# EAGLE board draft10_tofab (EAGLE 6.3)
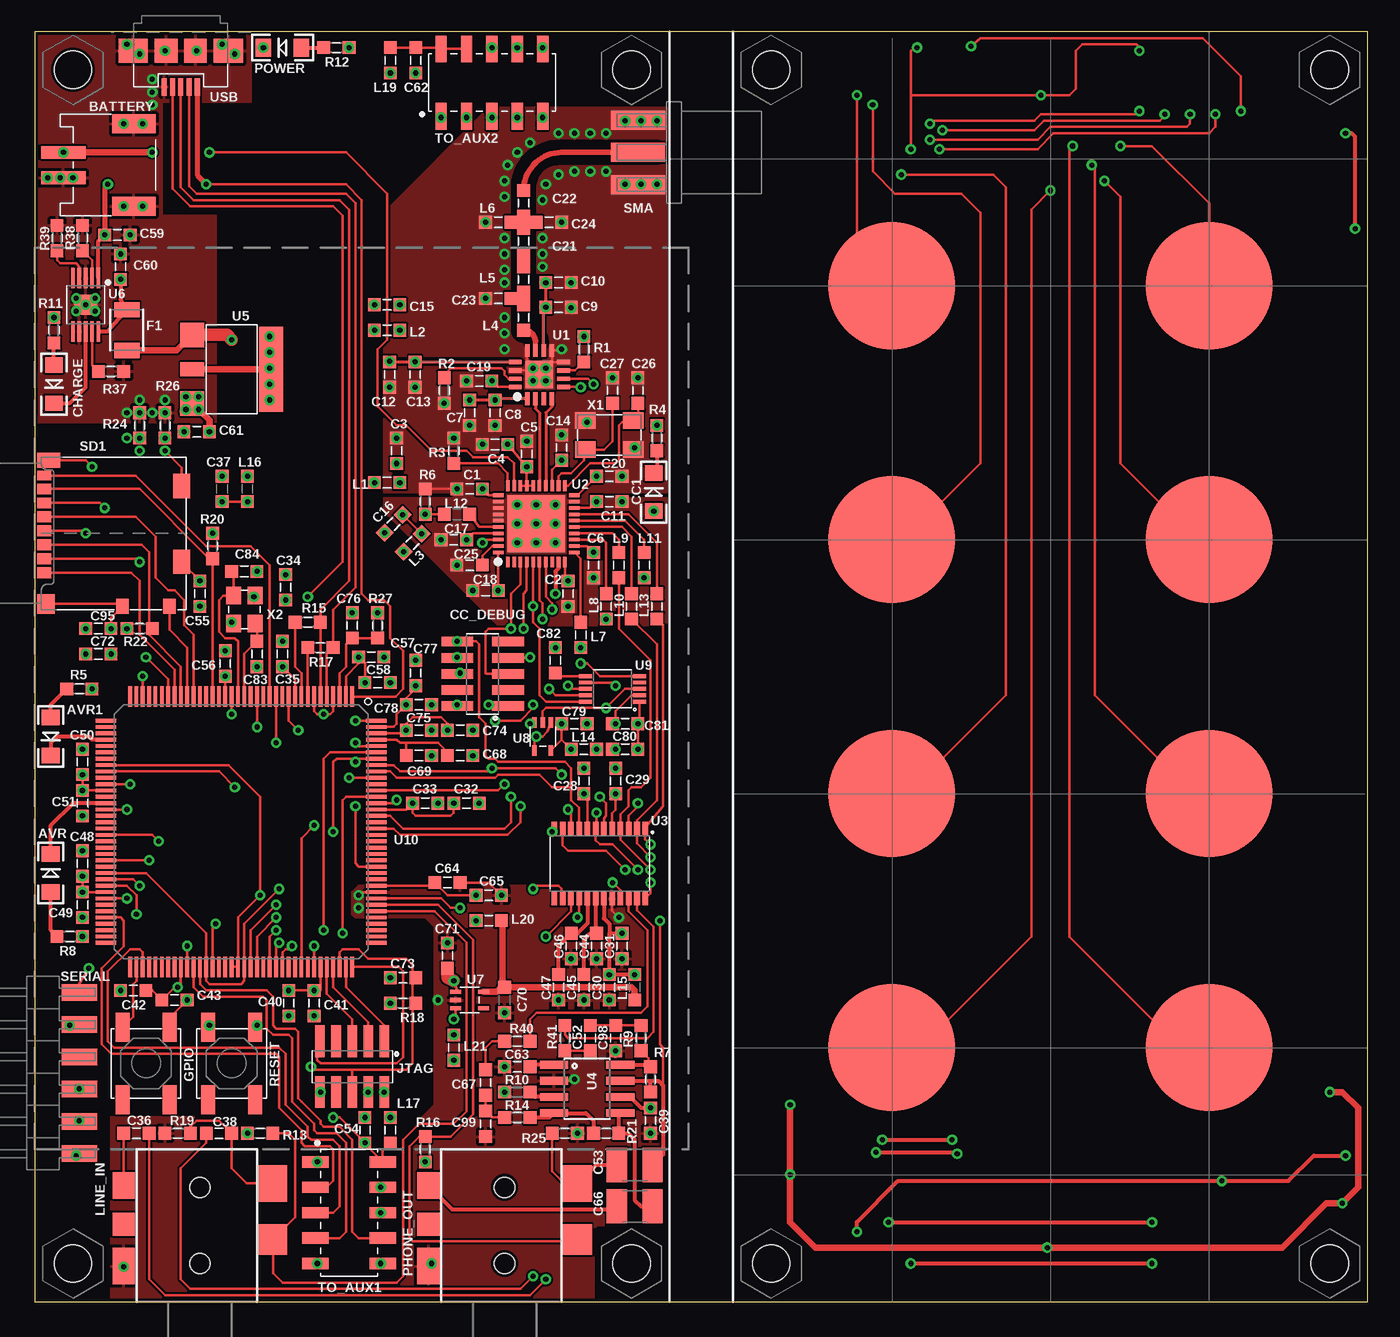
[diagram p5: board, top side]
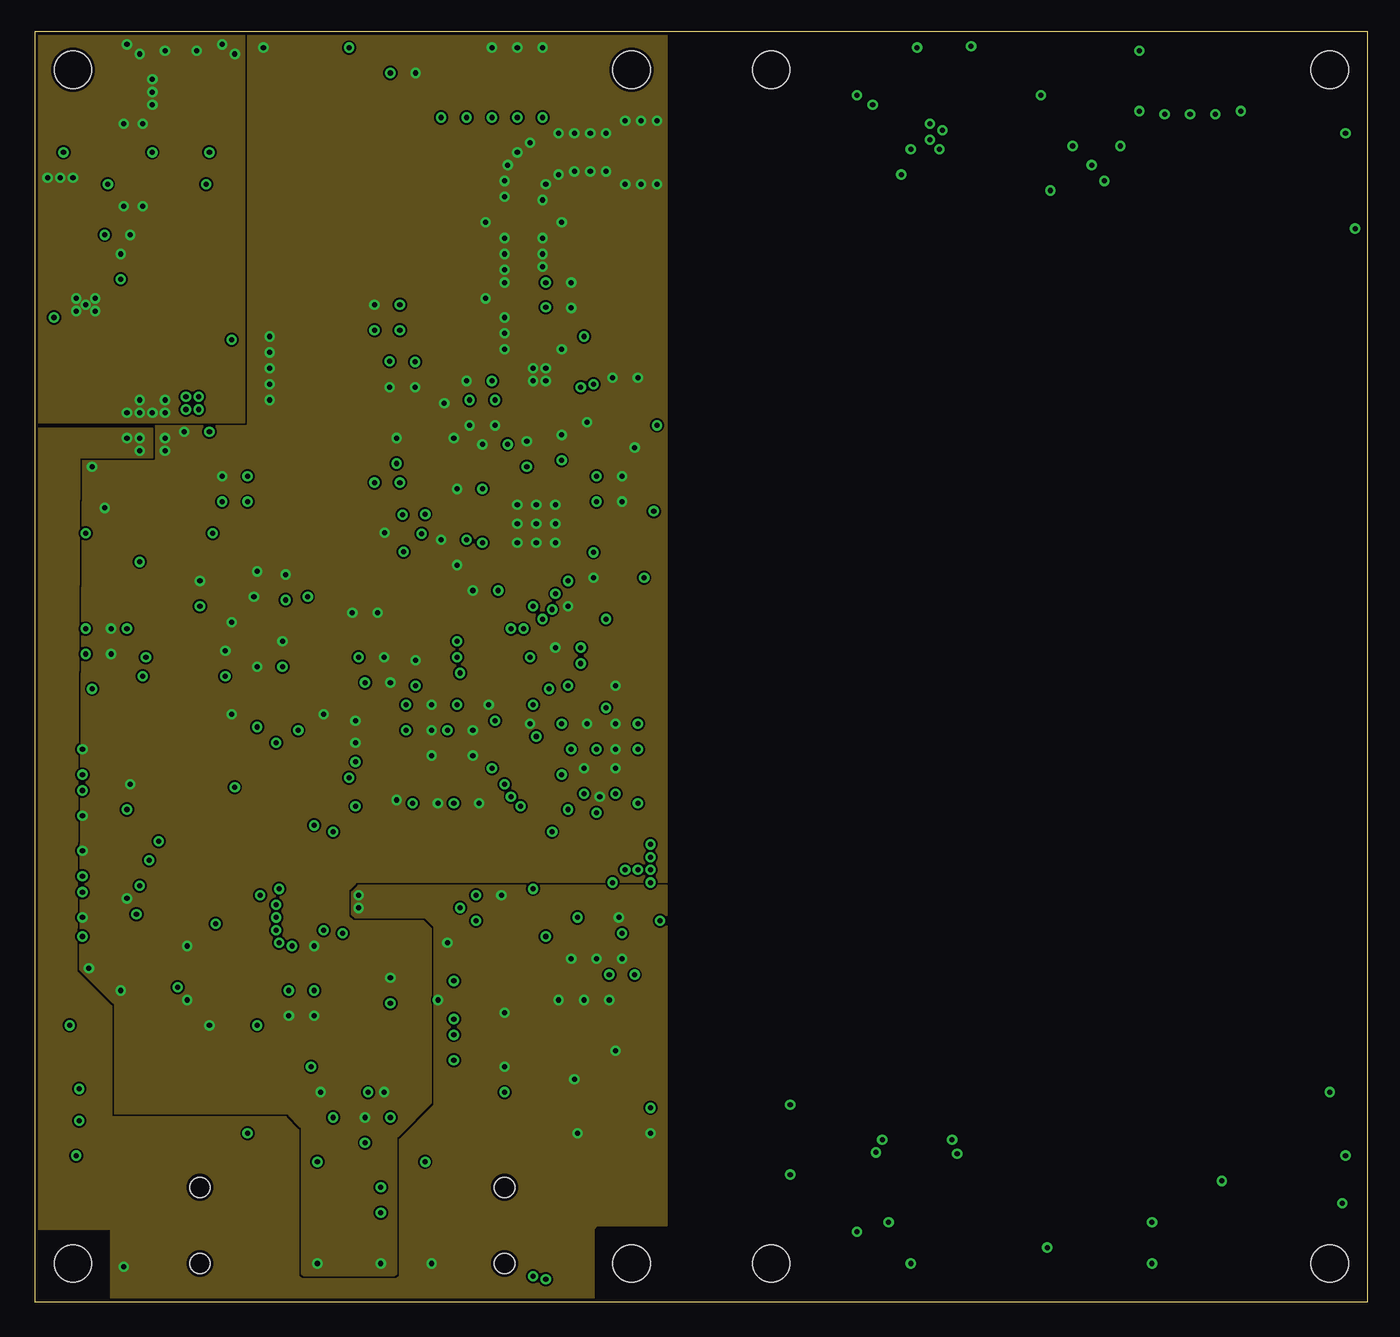
[diagram p6: board, inner layer Route2]
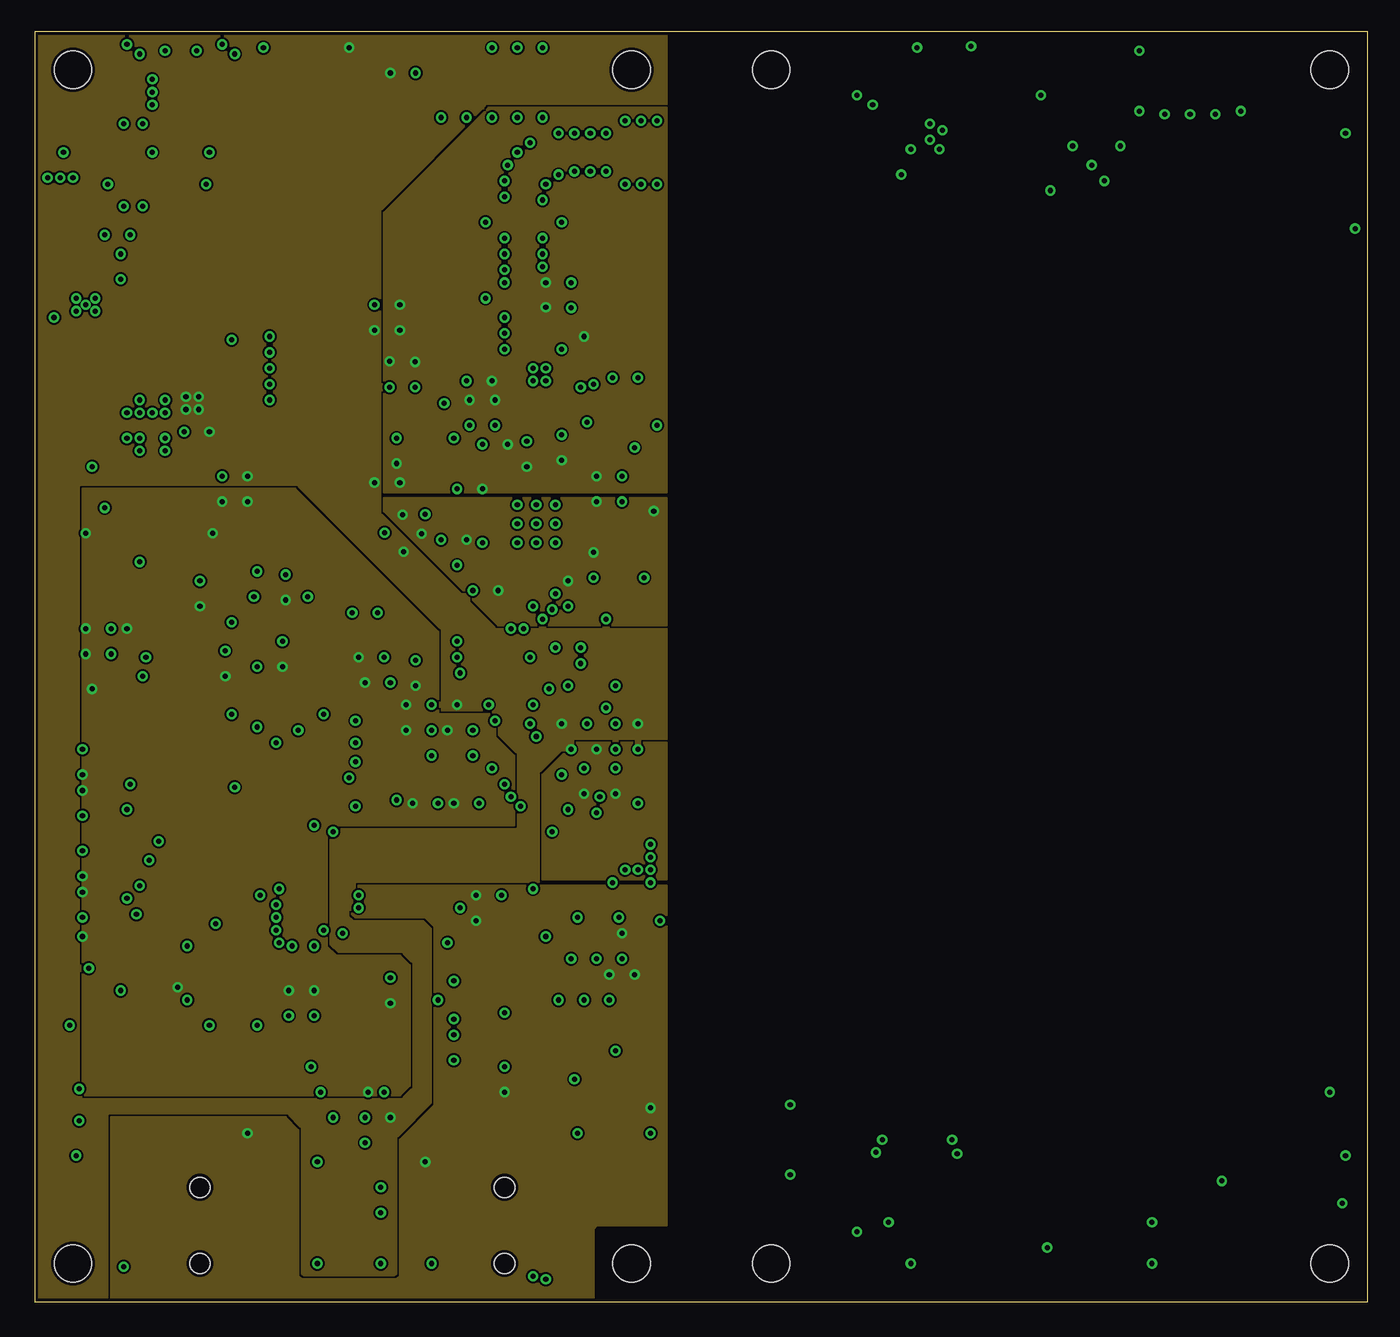
[diagram p7: board, inner layer Route3]
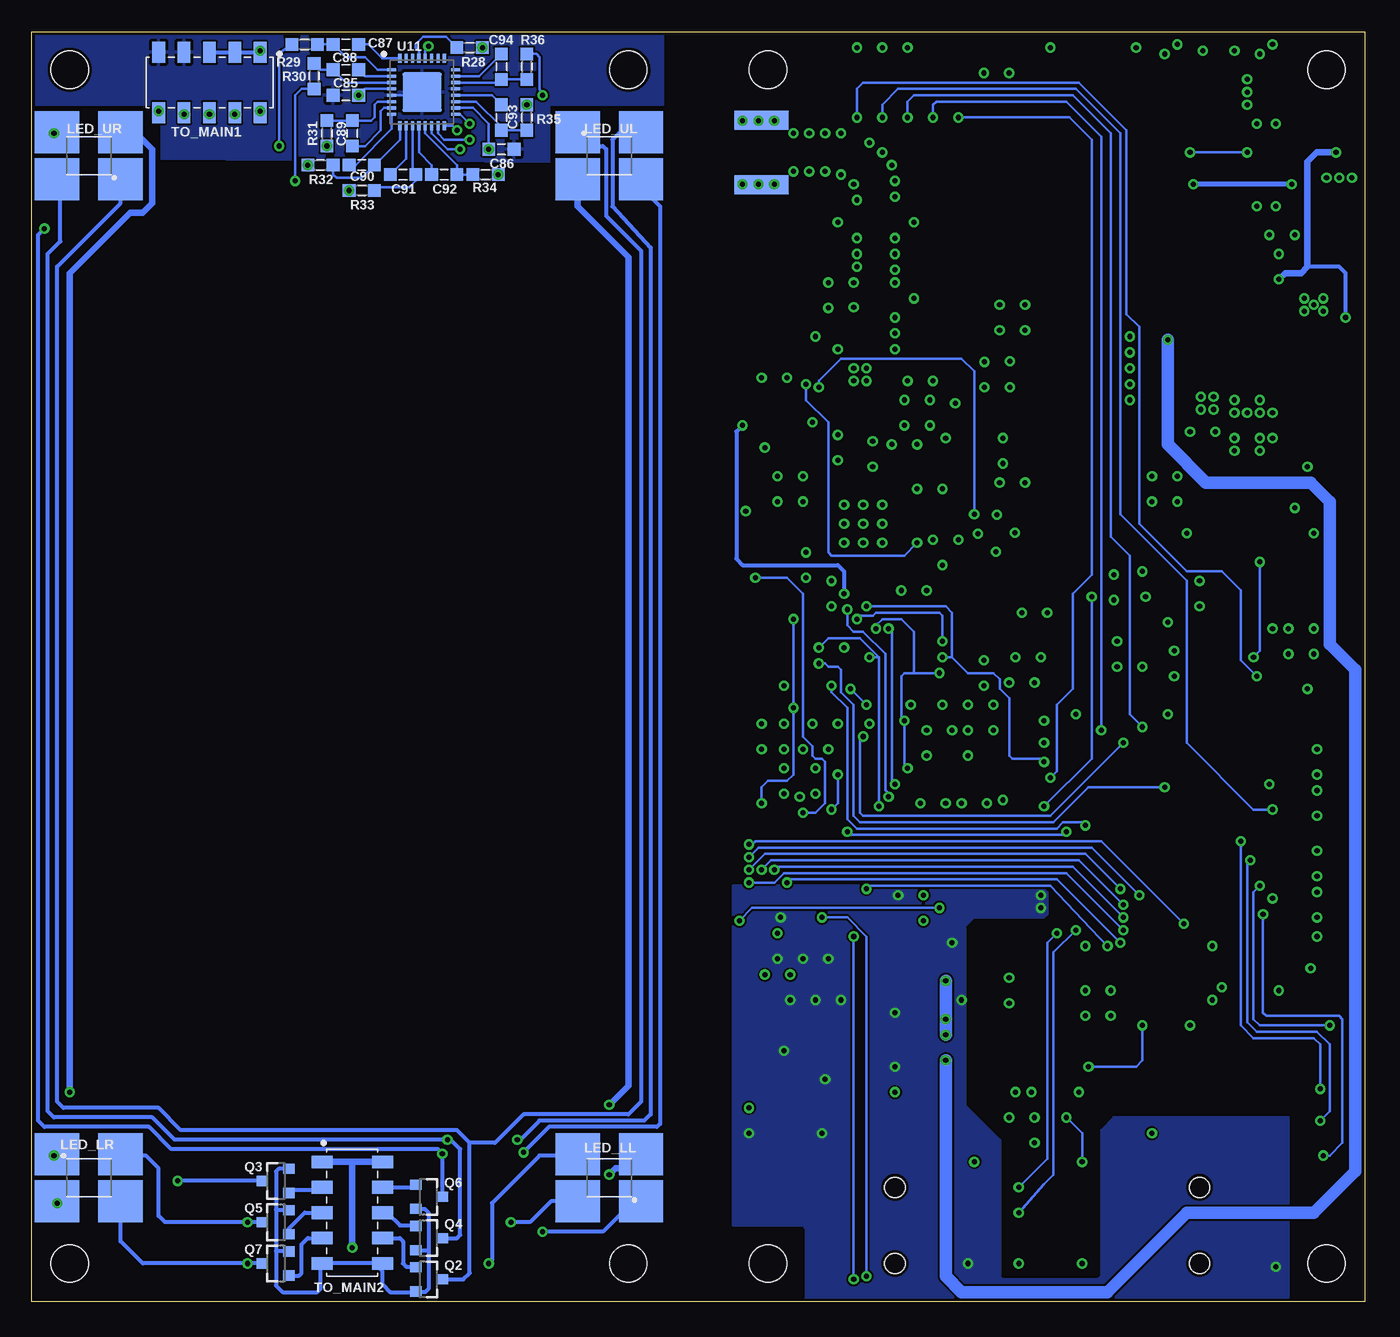
[diagram p8: board, bottom side, seen from below]

Size 105 x 100 mm. Coordinates in mm from the lower left corner, seen from the top.
Outline: 0,0 105,0 105,100 0,100 0,0
Copper layers (1+2*3+16): Top 0.034290625mm / dielectric 0.24891875mm / Route2 0.034290625mm / dielectric 39mil / Route3 0.034290625mm / dielectric 0.24891875mm / Bottom 0.034290625mm
Design rules "66each *": minimum track width 6mil, minimum drill 15mil, track to track 6mil, track to pad 6mil, pad to pad 6mil, via to via 6mil, smd to smd 0mil, copper to edge 10mil, drill to drill 10mil, minimum pad ring 10mil, minimum via ring 8mil, stop-mask expansion 4mil, vias tented up to drill 0mil, thermal gap 10mil
tRestrict: 7 lines

## Footprints (pad centres in the part's own frame; a part is rotated, then mirrored left to right if it is on the bottom)
LED-1206 = smd 1.2 x 1.4: A -1.5,0; C 1.5,0
1775469-2 = smd 1 x 3.5: + -1,-1.75; - 1,-1.75 | smd 1.5 x 3.4: X1 -3.25,3.8; X2 3.25,3.8
TOUCH-CIRCLE-10MM = smd 10 x 10: P$1 0,0
C0603 = smd 1 x 1: 1 -1,0; 2 1,0
C1210 = smd 1.6 x 2.7: 1 -1.4,0; 2 1.4,0
HEADER-10P-1.27MM = smd 0.75 x 2.5: 1 -2.54,-2; 2 -2.54,2; 3 -1.27,-2; 4 -1.27,2; 5 0,-2; 6 0,2; 7 1.27,-2; 8 1.27,2; 9 2.54,-2; 10 2.54,2
1210 = smd 1.2 x 2: 1 -1.6,0; 2 1.6,0
PTS-525 = smd 2.3 x 1.1: 1 -2.85,1.85; 2 2.85,1.85; 3 -2.85,-1.85; 4 2.85,-1.85
0603 = smd 1 x 1: 1 -1,0; 2 1,0
PLCC-4 = smd 1.5 x 1.1: 1 -1.5,0.75; 2 -1.5,-0.75; 3 1.5,-0.75; 4 1.5,0.75 | smd 3.5 x 3.3: 1-2 -2.5,1.85; 2-2 -2.5,-1.85; 3-2 2.5,-1.85; 4-2 2.5,1.85
STX-35332-5N = smd 1.75 x 2.1: 1 -6,9.15 | smd 1.75 x 1.8: 2 -6,6.1 | smd 2.25 x 2.4: 3 5.75,4.9 | smd 2.25 x 2.9: 4 5.75,9.3 | smd 1.75 x 2.9: 5 -6,2.8 | hole 1.6: 0,9; 0,3
SOT23-3 = smd 0.8 x 0.9: 1 -0.95,-1; 2 0.95,-1; 3 0,1.1
R0603 = smd 1 x 1: 1 -1,0; 2 1,0
MOLEX_104031-0811 = smd 0.85 x 1.1: CD/DAT3 2.005,0.25; CLK -1.295,0.25; CMD 0.905,0.25; DAT0 -3.495,0.25; DAT2 3.105,0.25; VDD -0.195,0.25; VSS -2.395,0.25 | smd 0.75 x 1.1: DAT1 -4.545,0.25 | smd 1.55 x 1.35: GND1 5.565,0.375 | smd 1.17 x 1.8: GND2 -5.755,0.6 | smd 1.9 x 1.35: GND3 -3.73,11.075; GND4 2.24,11.075 | smd 1.2 x 1: SWA 5.74,6.4; SWB 5.74,10.1
HEADER-3M-961-6P-2.54MM = smd 1.3 x 2.8: 1 -6.35,0; 2 -3.81,0; 3 -1.27,0; 4 1.27,0; 5 3.81,0; 6 6.35,0
CONREVSMA003.062 = smd 4.25 x 1.5 bottom: GND1 2.25,-2.54; GND3 2.25,2.54 | smd 4.25 x 1.5: GND2 2.25,-2.54; GND4 2.25,2.54; SIG 2.25,0
M22-63405 = smd 0.89 x 2.1: 1 -4,-2.65; 2 -4,2.65; 3 -2,-2.65; 4 -2,2.65; 5 0,-2.65; 6 0,2.65; 7 2,-2.65; 8 2,2.65; 9 4,-2.65; 10 4,2.65
M22-53205 = smd 1 x 1.65: 1 -4,-2.375; 2 -4,2.375; 3 -2,-2.375; 4 -2,2.375; 5 0,-2.375; 6 0,2.375; 7 2,-2.375; 8 2,2.375; 9 4,-2.375; 10 4,2.375
S-PVQFN-N16 = smd 1 x 0.35: 1 -1.9,0.975; 2 -1.9,0.325; 3 -1.9,-0.325; 4 -1.9,-0.975; 9 1.9,-0.975; 10 1.9,-0.325; 11 1.9,0.325; 12 1.9,0.975 | smd 0.35 x 1: 5 -0.975,-1.9; 6 -0.325,-1.9; 7 0.325,-1.9; 8 0.975,-1.9; 13 0.975,1.9; 14 0.325,1.9; 15 -0.325,1.9; 16 -0.975,1.9 | smd 2.16 x 2.16: GND 0,0
S-PVQFN-N40 = smd 0.85 x 0.28: 1 -3,2.25; 2 -3,1.75; 3 -3,1.25; 4 -3,0.75; 5 -3,0.25; 6 -3,-0.25; 7 -3,-0.75; 8 -3,-1.25; 9 -3,-1.75; 10 -3,-2.25; 21 3,-2.25; 22 3,-1.75; 23 3,-1.25; 24 3,-0.75; 25 3,-0.25; 26 3,0.25; 27 3,0.75; 28 3,1.25; 29 3,1.75; 30 3,2.25 | smd 0.28 x 0.85: 11 -2.25,-3; 12 -1.75,-3; 13 -1.25,-3; 14 -0.75,-3; 15 -0.25,-3; 16 0.25,-3; 17 0.75,-3; 18 1.25,-3; 19 1.75,-3; 20 2.25,-3; 31 2.25,3; 32 1.75,3; 33 1.25,3; 34 0.75,3; 35 0.25,3; 36 -0.25,3; 37 -0.75,3; 38 -1.25,3; 39 -1.75,3; 40 -2.25,3 | smd 4.5 x 4.5: GND 0,0
TSSOP-24L = smd 1.05 x 0.45: 1 -2.775,3.575; 2 -2.775,2.925; 3 -2.775,2.275; 4 -2.775,1.625; 5 -2.775,0.975; 6 -2.775,0.325; 7 -2.775,-0.325; 8 -2.775,-0.975; 9 -2.775,-1.625; 10 -2.775,-2.275; 11 -2.775,-2.925; 12 -2.775,-3.575; 13 2.775,-3.575; 14 2.775,-2.925; 15 2.775,-2.275; 16 2.775,-1.625; 17 2.775,-0.975; 18 2.775,-0.325; 19 2.775,0.325; 20 2.775,0.975; 21 2.775,1.625; 22 2.775,2.275; 23 2.775,2.925; 24 2.775,3.575
SO08 = smd 0.61 x 2.21: 1 -1.905,-2.616; 2 -0.635,-2.616; 3 0.635,-2.616; 4 1.905,-2.616; 5 1.905,2.616; 6 0.635,2.616; 7 -0.635,2.616; 8 -1.905,2.616
SOT-223 = smd 1.9 x 1.9: 1 -2.7,-3.1; 3 2.7,-3.1 | smd 1.1 x 1.9: 2 0,-3.1 | smd 6.7 x 1.9: 4 0,3.1
S-PDSO-G10 = smd 1.6 x 0.3: 1 -2.1,1; 2 -2.1,0.5; 3 -2.1,0; 4 -2.1,-0.5; 5 -2.1,-1; 6 2.1,-1; 7 2.1,-0.5; 8 2.1,0; 9 2.1,0.5; 10 2.1,1 | smd 1.57 x 1.88: GND 0,0
SOT-23-5 = smd 0.35 x 0.85: 1 -0.65,-1.1; 2 0,-1.1; 3 0.65,-1.1; 4 0.65,1.1; 5 -0.65,1.1
MSOP-10L = smd 1 x 0.305: 1 -2.125,1; 2 -2.125,0.5; 3 -2.125,0; 4 -2.125,-0.5; 5 -2.125,-1; 6 2.125,-1; 7 2.125,-0.5; 8 2.125,0; 9 2.125,0.5; 10 2.125,1
LQFP-144 = smd 1.6 x 0.3: 1 -10.65,8.75; 2 -10.65,8.25; 3 -10.65,7.75; 4 -10.65,7.25; 5 -10.65,6.75; 6 -10.65,6.25; 7 -10.65,5.75; 8 -10.65,5.25; 9 -10.65,4.75; 10 -10.65,4.25; 11 -10.65,3.75; 12 -10.65,3.25; 13 -10.65,2.75; 14 -10.65,2.25; 15 -10.65,1.75; 16 -10.65,1.25; 17 -10.65,0.75; 18 -10.65,0.25; 19 -10.65,-0.25; 20 -10.65,-0.75; 21 -10.65,-1.25; 22 -10.65,-1.75; 23 -10.65,-2.25; 24 -10.65,-2.75; 25 -10.65,-3.25; 26 -10.65,-3.75; 27 -10.65,-4.25; 28 -10.65,-4.75; 29 -10.65,-5.25; 30 -10.65,-5.75; 31 -10.65,-6.25; 32 -10.65,-6.75; 33 -10.65,-7.25; 34 -10.65,-7.75; 35 -10.65,-8.25; 36 -10.65,-8.75; 73 10.65,-8.75; 74 10.65,-8.25; 75 10.65,-7.75; 76 10.65,-7.25; 77 10.65,-6.75; 78 10.65,-6.25; 79 10.65,-5.75; 80 10.65,-5.25; 81 10.65,-4.75; 82 10.65,-4.25; 83 10.65,-3.75; 84 10.65,-3.25; 85 10.65,-2.75; 86 10.65,-2.25; 87 10.65,-1.75; 88 10.65,-1.25; 89 10.65,-0.75; 90 10.65,-0.25; 91 10.65,0.25; 92 10.65,0.75; 93 10.65,1.25; 94 10.65,1.75; 95 10.65,2.25; 96 10.65,2.75; 97 10.65,3.25; 98 10.65,3.75; 99 10.65,4.25; 100 10.65,4.75; 101 10.65,5.25; 102 10.65,5.75; 103 10.65,6.25; 104 10.65,6.75; 105 10.65,7.25; 106 10.65,7.75; 107 10.65,8.25; 108 10.65,8.75 | smd 0.3 x 1.6: 37 -8.75,-10.65; 38 -8.25,-10.65; 39 -7.75,-10.65; 40 -7.25,-10.65; 41 -6.75,-10.65; 42 -6.25,-10.65; 43 -5.75,-10.65; 44 -5.25,-10.65; 45 -4.75,-10.65; 46 -4.25,-10.65; 47 -3.75,-10.65; 48 -3.25,-10.65; 49 -2.75,-10.65; 50 -2.25,-10.65; 51 -1.75,-10.65; 52 -1.25,-10.65; 53 -0.75,-10.65; 54 -0.25,-10.65; 55 0.25,-10.65; 56 0.75,-10.65; 57 1.25,-10.65; 58 1.75,-10.65; 59 2.25,-10.65; 60 2.75,-10.65; 61 3.25,-10.65; 62 3.75,-10.65; 63 4.25,-10.65; 64 4.75,-10.65; 65 5.25,-10.65; 66 5.75,-10.65; 67 6.25,-10.65; 68 6.75,-10.65; 69 7.25,-10.65; 70 7.75,-10.65; 71 8.25,-10.65; 72 8.75,-10.65; 109 8.75,10.65; 110 8.25,10.65; 111 7.75,10.65; 112 7.25,10.65; 113 6.75,10.65; 114 6.25,10.65; 115 5.75,10.65; 116 5.25,10.65; 117 4.75,10.65; 118 4.25,10.65; 119 3.75,10.65; 120 3.25,10.65; 121 2.75,10.65; 122 2.25,10.65; 123 1.75,10.65; 124 1.25,10.65; 125 0.75,10.65; 126 0.25,10.65; 127 -0.25,10.65; 128 -0.75,10.65; 129 -1.25,10.65; 130 -1.75,10.65; 131 -2.25,10.65; 132 -2.75,10.65; 133 -3.25,10.65; 134 -3.75,10.65; 135 -4.25,10.65; 136 -4.75,10.65; 137 -5.25,10.65; 138 -5.75,10.65; 139 -6.25,10.65; 140 -6.75,10.65; 141 -7.25,10.65; 142 -7.75,10.65; 143 -8.25,10.65; 144 -8.75,10.65
QFN-32 = smd 0.7 x 0.25: 1 -2.4,1.75; 2 -2.4,1.25; 3 -2.4,0.75; 4 -2.4,0.25; 5 -2.4,-0.25; 6 -2.4,-0.75; 7 -2.4,-1.25; 8 -2.4,-1.75; 17 2.65,-1.75; 18 2.65,-1.25; 19 2.65,-0.75; 20 2.65,-0.25; 21 2.65,0.25; 22 2.65,0.75; 23 2.65,1.25; 24 2.65,1.75 | smd 0.25 x 0.7: 9 -1.75,-2.65; 10 -1.25,-2.65; 11 -0.75,-2.65; 12 -0.25,-2.65; 13 0.25,-2.65; 14 0.75,-2.65; 15 1.25,-2.65; 16 1.75,-2.65; 25 1.75,2.65; 26 1.25,2.65; 27 0.75,2.65; 28 0.25,2.65; 29 -0.25,2.65; 30 -0.75,2.65; 31 -1.25,2.65; 32 -1.75,2.65 | smd 3.1 x 3.1: GND 0,0
STANDOFF_3/16 = hole 2.946: 0,0
USB_MICRO_AB = smd 0.4 x 1.4: 1 -1.3,2.85; 2 -0.65,2.85; 3 0,2.85; 4 0.65,2.85; 5 1.3,2.85 | smd 2.3 x 1.9: GND1 -3.75,0; GND4 3.75,0 | smd 1.8 x 1.9: GND2 -1.15,0; GND3 1.15,0
ABM3C = smd 1.6 x 1.3: 1 -1.9,-1.15; 2 1.9,-1.15; 3 1.9,1.15; 4 -1.9,1.15
ABM8G = smd 1.4 x 1.2: GND-1 -1.1,0.85; GND-2 1.1,-0.85; X1 1.1,0.85; X2 -1.1,-0.85

## Placement (x,y rotation side)
AVR  [LED-1206]  1.25,33.75 90 top
AVR1  [LED-1206]  1.25,44.5 270 top
BATTERY  BATTERY-LIPO-JST  [1775469-2]  4,89.5 270 top
BUTTON  TOUCH_PAD-CIRCLE-10MM  [TOUCH-CIRCLE-10MM]  92.5,20 0 top
C1  100n  [C0603]  34.25,64 180 top
C2  100n  [C0603]  42,55.75 270 top
C3  2.2u  [C0603]  28.5,67 90 top
C4  100n_HF  [C0603]  36.25,67.5 180 top
C5  220p_HF  [C0603]  38.75,66.75 90 top
C6  100n  [C0603]  44,58 270 top
C7  1n  [C0603]  34.25,70 270 top
C8  10p  [C0603]  36.25,70 270 top
C9  18p  [C0603]  41.25,78.3 0 top
C10  1n  [C0603]  41.25,80.25 0 top
C11  100n  [C0603]  45.25,63 0 top
C12  1n  [C0603]  27.95,73 270 top
C13  10p  [C0603]  29.95,73 270 top
C14  100n  [C0603]  41.5,67.25 90 top
C15  2.2u  [C0603]  27.75,78.5 180 top
C16  2.2u  [C0603]  28.25,61.25 225 top
C17  100n  [C0603]  33,60 180 top
C18  1u  [C0603]  35.5,56 180 top
C19  1n  [C0603]  35,72.5 180 top
C20  100n  [C0603]  45.25,65 0 top
C21  6.8p_HF  [C0603]  38.5,83.5 90 top
C22  100p_HF  [C0603]  38.5,86.5 90 top
C23  1.2p_HF  [C0603]  36.5,79 180 top
C24  1.8p_HF  [C0603]  40.5,85 0 top
C25  1u  [C0603]  34.25,58 180 top
C26  27p  [C0603]  47.5,71.75 90 top
C27  27p  [C0603]  45.5,71.75 90 top
C28  1u  [C0603]  43.25,41 90 top
C29  100n  [C0603]  45.75,41 90 top
C30  100n  [C0603]  45.25,24.75 270 top
C31  1u  [C0603]  46.25,28 270 top
C32  1u  [C0603]  34,39.25 0 top
C33  1n  [C0603]  30.75,39.25 0 top
C34  1u  [C0603]  19.75,56.25 90 top
C35  1n  [C0603]  19.5,51 90 top
C36  470n  [C0603]  8,13.25 0 top
C37  2.2u  [C0603]  14.75,64 90 top
C38  470n  [C0603]  14.5,13.25 180 top
C39  100n  [C0603]  48.5,14.25 270 top
C40  1u  [C0603]  20,23.5 270 top
C41  1n  [C0603]  22,23.5 270 top
C42  1u  [C0603]  7.75,24.5 180 top
C43  1n  [C0603]  11,23.75 0 top
C44  100n  [C0603]  44.25,28 270 top
C45  10u  [C0603]  43.25,24.75 270 top
C46  100n  [C0603]  42.25,28 270 top
C47  10u  [C0603]  41.25,24.75 270 top
C48  1u  [C0603]  3.75,34.5 90 top
C49  1n  [C0603]  3.75,31.25 270 top
C50  1u  [C0603]  3.75,42.5 90 top
C51  1n  [C0603]  3.75,39.25 270 top
C52  1u  [C0603]  43.75,20.75 90 top
C53  220u  [C1210]  47.25,10.75 180 top
C54  2.2u  [C0603]  26,13.5 90 top
C55  1u  [C0603]  13,55.75 90 top
C56  1n  [C0603]  15,50.25 90 top
C57  1u  [C0603]  26.5,50.75 0 top
C58  1n  [C0603]  27,48.75 0 top
C59  10u  [C0603]  6.5,84 0 top
C60  10u  [C0603]  6.75,81.5 90 top
C61  10u  [C0603]  12.75,68.5 180 top
C62  2.2u  [C0603]  30,97.75 270 top
C63  1u  [C0603]  38,18.5 180 top
C64  100n  [C0603]  32.5,33 0 top
C65  1u  [C0603]  35.75,32 0 top
C66  220u  [C1210]  47.25,7.5 180 top
C67  1u  [C0603]  35.5,17.25 270 top
C68  1u  [C0603]  33.5,43 0 top
C69  1n  [C0603]  30.25,43 0 top
C70  10u  [C0603]  37,23.75 270 top
C71  1u  [C0603]  32.5,27.25 90 top
C72  1u  [C0603]  5,51 0 top
C73  100n  [C0603]  29,25.5 180 top
C74  1u  [C0603]  33.5,45 0 top
C75  1n  [C0603]  30.25,45 0 top
C76  10p  [C0603]  25,53.25 90 top
C77  1u  [C0603]  30,49.5 90 top
C78  1n  [C0603]  30.25,47 0 top
C79  100n  [C0603]  42.5,45.5 0 top
C80  1u  [C0603]  46.5,43.5 180 top
C81  100n  [C0603]  46.5,45.5 180 top
C82  100n  [C0603]  41,50.5 90 top
C83  10p  [C0603]  17.5,51 270 top
C84  10p  [C0603]  16.5,57.5 0 top
C85  100n  [C0603]  80.25,95 180 bottom
C86  100n  [C0603]  68,90.75 0 bottom
C87  10n  [C0603]  80.25,99 180 bottom
C88  10n  [C0603]  80.25,97 180 bottom
C89  10n  [C0603]  79.75,92 90 bottom
C90  10n  [C0603]  79,89.5 0 bottom
C91  10n  [C0603]  75.75,88.75 0 bottom
C92  10n  [C0603]  72.5,88.75 0 bottom
C93  10n  [C0603]  68,93.25 270 bottom
C94  10n  [C0603]  68,97.25 270 bottom
C95  100n  [C0603]  5,53 0 top
C98  470n  [C0603]  45.75,20.75 270 top
C99  470n  [C0603]  35.5,14 270 top
CC1  [LED-1206]  48.75,63.75 90 top
CC_DEBUG  HEADER-10P-SMD-MALE2  [HEADER-10P-1.27MM]  35.27,49.43 90 top
CHARGE  [LED-1206]  1.5,72.25 270 top
F1  2A  [1210]  7.25,76.5 270 top
GPIO  TACT_SWITCH-PTS-525  [PTS-525]  8.75,18.75 90 top
JTAG  HEADER-10P-SMD-MALE2  [HEADER-10P-1.27MM]  25,18.5 180 top
L1  BEAD_HF  [0603]  27.75,64.5 180 top
L2  BEAD_HF  [0603]  27.75,76.5 180 top
L3  BEAD  [0603]  29.75,59.75 225 top
L4  2.2n_HF  [0603]  38.5,77.5 90 top
L5  3.9n_HF  [0603]  38.5,80.5 90 top
L6  1.5n_HF  [0603]  36.5,85 0 top
L7  6.8n  [0603]  43,52.5 270 top
L8  6.8n  [0603]  45,54.75 90 top
L9  6.8n  [0603]  46,58 90 top
L10  6.8n  [0603]  47,54.75 90 top
L11  6.8n  [0603]  48,58 90 top
L12  6.8n  [0603]  33.25,62 180 top
L13  6.8n  [0603]  49,54.75 90 top
L14  BEAD  [0603]  43.25,43.5 180 top
L15  BEAD  [0603]  47.25,24.75 270 top
L16  BEAD  [0603]  16.75,64 90 top
L17  BEAD  [0603]  28,13.5 90 top
L19  BEAD  [0603]  28,97.75 270 top
L20  BEAD  [0603]  35.75,30 0 top
L21  BEAD  [0603]  33,20 270 top
LED_LL  LED_RGB  [PLCC-4]  59.5,9.75 180 bottom
LED_LR  LED_RGB  [PLCC-4]  100.5,9.75 0 bottom
LED_UL  LED_RGB  [PLCC-4]  59.5,90.25 0 bottom
LED_UR  LED_RGB  [PLCC-4]  100.5,90.25 180 bottom
LINE_IN  PHONE_SW-STX-35332-5N  [STX-35332-5N]  13,0 0 top
NEXT  TOUCH_PAD-CIRCLE-10MM  [TOUCH-CIRCLE-10MM]  92.5,60 0 top
PHONE_OUT  PHONE_SW-STX-35332-5N  [STX-35332-5N]  37,0 0 top
PLAY/PAUSE  TOUCH_PAD-CIRCLE-10MM  [TOUCH-CIRCLE-10MM]  67.5,80 0 top
POWER  [LED-1206]  19.5,98.75 180 top
PREV  TOUCH_PAD-CIRCLE-10MM  [TOUCH-CIRCLE-10MM]  67.5,60 0 top
Q2  2N7002  [SOT23-3]  73.75,1.75 270 bottom
Q3  2N7002  [SOT23-3]  85.75,9.5 90 bottom
Q4  2N7002  [SOT23-3]  73.75,5 270 bottom
Q5  2N7002  [SOT23-3]  85.75,6.25 90 bottom
Q6  2N7002  [SOT23-3]  73.75,8.25 270 bottom
Q7  2N7002  [SOT23-3]  85.75,3 90 bottom
R1  4.32K  [R0603]  43.25,75 90 top
R2  4.32K  [R0603]  32.25,71.75 90 top
R3  56.2K  [R0603]  33,67 270 top
R4  100  [R0603]  49,68 270 top
R5  100  [R0603]  3.5,48.25 0 top
R6  10K  [R0603]  30.75,63 270 top
R7  20K  [R0603]  48.5,17.5 90 top
R8  100  [R0603]  2.75,28.75 0 top
R9  20K  [R0603]  47.75,20.75 90 top
R10  10K  [R0603]  38,16.5 180 top
R11  332  [R0603]  1.5,76.5 90 top
R12  100  [R0603]  23.75,98.75 0 top
R13  1M  [R0603]  17.75,13.25 180 top
R14  20K  [R0603]  38,14.5 180 top
R15  39  [R0603]  21.5,53.5 0 top
R16  1M  [R0603]  30.75,12 270 top
R17  39  [R0603]  22.5,51.5 0 top
R18  10K  [R0603]  29,23.5 180 top
R19  100K  [R0603]  11.25,13.25 0 top
R20  100K  [R0603]  14,59.5 90 top
R21  20K  [R0603]  45,13.25 180 top
R22  100K  [R0603]  8.25,53 180 top
R24  0  [R0603]  8.25,69 270 top
R25  100K  [R0603]  41.75,13.25 180 top
R26  0  [R0603]  10.25,69 270 top
R27  6.81K  [R0603]  27,53.25 270 top
R28  100K  [R0603]  70.5,98.75 0 bottom
R29  4.64K  [R0603]  83.5,99 180 bottom
R30  4.64K  [R0603]  82.75,96.5 270 bottom
R31  4.64K  [R0603]  81.75,92 270 bottom
R32  4.64K  [R0603]  82.25,89.5 180 bottom
R33  4.64K  [R0603]  79,87.5 180 bottom
R34  4.64K  [R0603]  69.25,88.75 0 bottom
R35  4.64K  [R0603]  66,93.25 90 bottom
R36  4.64K  [R0603]  66,97.25 90 bottom
R37  10K  [R0603]  6,73.25 180 top
R38  681  [R0603]  3.75,83.75 270 top
R39  4.53K  [R0603]  1.75,83.75 270 top
R40  1K  [R0603]  38,20.5 0 top
R41  1K  [R0603]  41.75,20.75 90 top
RESET  TACT_SWITCH-PTS-525  [PTS-525]  15.5,18.75 270 top
SD1  MICROSD104031-0811  [MOLEX_104031-0811]  0.5,60.5 270 top
SERIAL  HEADER-6X1-961106-5500  [HEADER-3M-961-6P-2.54MM]  3.5,18 90 top
SMA  SMA-REVSMA-0.62  [CONREVSMA003.062]  49.75,90.5 180 top
STOP  TOUCH_PAD-CIRCLE-10MM  [TOUCH-CIRCLE-10MM]  92.5,80 0 top
TO_AUX1  HEADER-10P-SMD-2MM-FEMALE  [M22-63405]  24.75,7 270 top
TO_AUX2  HEADER-10P-SMD-2MM-FEMALE  [M22-63405]  36,96 0 top
TO_MAIN1  HEADER-10P-SMD-2MM-MALE  [M22-53205]  91,96 180 bottom
TO_MAIN2  HEADER-10P-SMD-2MM-MALE  [M22-53205]  79.75,7 270 bottom
U1  CC2591  [S-PVQFN-N16]  39.75,73 90 top
U2  CC85XX  [S-PVQFN-N40]  39.5,61.25 90 top
U3  CS4270-TSSOP24  [TSSOP-24L]  44.5,34.5 270 top
U4  LM4881  [SO08]  43.5,16.75 270 top
U5  [SOT-223]  15.5,73.42 270 top
U6  BQ2409XDGQ  [S-PDSO-G10]  4,78.5 270 top
U7  TLV700DDC  [SOT-23-5]  34.25,23.75 270 top
U8  SN74LVC1G80DBV  [SOT-23-5]  40,44.5 180 top
U9  CS2300-MSOP10L  [MSOP-10L]  45.5,48.25 180 top
U10  AT32UC3A3-LQFP-144  [LQFP-144]  16.25,37 270 top
U11  AT42QT1110-QFN-32  [QFN-32]  74.25,95.25 0 bottom
U$1  [STANDOFF_3/16]  3,3 0 top
U$2  [STANDOFF_3/16]  47,3 0 top
U$3  [STANDOFF_3/16]  47,97 0 top
U$4  [STANDOFF_3/16]  3,97 0 top
U$5  [UBBP01]  0,12 0 top
U$6  [STANDOFF_3/16]  58,97 0 top
U$7  [STANDOFF_3/16]  102,97 0 top
U$8  [STANDOFF_3/16]  58,3 0 top
U$9  [STANDOFF_3/16]  102,3 0 top
USB  USB_MICRO_AB  [USB_MICRO_AB]  11.5,98.5 180 top
VOL+  TOUCH_PAD-CIRCLE-10MM  [TOUCH-CIRCLE-10MM]  92.5,40 0 top
VOL-  TOUCH_PAD-CIRCLE-10MM  [TOUCH-CIRCLE-10MM]  67.5,40 0 top
WIRELESS  TOUCH_PAD-CIRCLE-10MM  [TOUCH-CIRCLE-10MM]  67.5,20 0 top
X1  48MHz  [ABM3C]  45.25,68.25 180 top
X2  12MHz  [ABM8G]  16.5,54.5 270 top

## Tracks (layer width: path | path; a pad name or v marks a point on that pad's centre or on a via)
!AVR_LED0
  Top 0.3: U10.50 3,39.25 1.25,37.5 AVR.C
!AVR_LED1
  Top 0.3: U10.40 4.5,44.25 4.25,44.5 1.75,44.5 1.25,44 AVR1.C
!CHANGE  (via drill 0.4)
  Top 0.2: TO_AUX2.9 v40,93.25 | v8.5,49.25 U10.34
  Bottom 0.2: v40,93.25 40,95.5 39.5,96 22.5,96 18.75,92.25 18.75,77.75 17.75,76.75 17.75,61.25 14,57.5 11.25,57.5 9.75,56 9.75,50.5 v8.5,49.25
!CS_CC8531  (via drill 0.4)
  Top 0.2: U10.133 36.5,40.25 v37,40.75 | U2.3 38.25,56.5 37.5,55.75 v37.5,53 35.75,53 35.5,52.75 35.5,49.5 35.57,49.43 CC_DEBUG.5
  Bottom 0.2: v37,40.75 37.25,41 37.25,52.75 v37.5,53
!CS_CLOCK  (via drill 0.4)
  Top 0.2: U9.8 42.25,48.25 v42,48.5 | U10.100 21,36.5 v22,37.5
  Bottom 0.2: v42,48.5 42,48 40.75,46.75 40.75,38 40,37.25 24.25,37.25 23.75,37.75 22.25,37.75 v22,37.5
!CS_CODEC  (via drill 0.4)
  Top 0.2: v19,30.25 17.5,28.75 U10.93 | U3.11 41.58,35.92 42,35.5 45,35.5 v46.5,34
  Bottom 0.2: v19,30.25 23,34.25 46.25,34.25 v46.5,34
!CS_TOUCH  (via drill 0.4)
  Top 0.2: TO_AUX2.7 38.15,93.35 v38,93.25 | v7.25,38.75 U10.51
  Bottom 0.2: v38,93.25 38,94.25 36.75,95.5 22.75,95.5 19.25,92 19.25,62 14,56.75 14,44 8.75,38.75 v7.25,38.75
!GPIO
  Top 0.2: U10.74 8,25.25 7.75,25 7.75,22.45 GPIO.2
!MUTE_L  (via drill 0.4)
  Top 0.2: U10.96 19,28 v19.25,28.25 | v45.5,33 46.12,32.38 U3.21
  Bottom 0.2: v19.25,28.25 24.25,33.25 45.25,33.25 v45.5,33
!MUTE_R  (via drill 0.4)
  Top 0.2: U10.95 18.5,28.75 v19,29.25 | v48.5,33 48.5,32.15 U3.24
  Bottom 0.2: v19,29.25 23.5,33.75 45.75,33.75 46.5,33 v48.5,33
!PAIR  (via drill 0.4)
  Top 0.2: U10.129 28,38.25 29,37.25 37,37.25 37.5,37.75 v37.5,39.75 | v40.75,54.5 40.75,55 40.25,55.5 U2.7
  Bottom 0.2: v40.75,54.5 40.75,53.25 40.25,52.75 39.5,52.75 37.75,51 37.75,40.25 37.5,40 v37.5,39.75
!RESET  (via drill 0.4)
  Top 0.2: U10.106 24,27.5 24.25,27.75 25.5,27.75 26.25,27 29.25,27 29.75,26.5 29.75,25.5 | 25,18.25 29.25,18.25 29.75,18.75 29.75,23.5 | 25,18.25 22,18.25 v21.75,18.5 | v17.5,21.75 RESET.1 | JTAG.6 25,18.25 | 29.75,23.5 29.75,25.5 | C73.1 29.75,25.5 | R18.1 29.75,23.5
  Bottom 0.2: v21.75,18.5 18,18.5 17.5,19 v17.5,21.75
!RESET_CC8531  (via drill 0.4)
  Top 0.2: U10.127 28.25,37.25 28.75,36.75 37.25,36.75 38.25,37.75 v38.25,39 | CC_DEBUG.7 38.95,50.7 v39,50.75
  Bottom 0.2: v39,50.75 38.25,50.75 | 38.25,50.75 39.75,52.25 42.25,52.25 L7.2 | 38.25,50.75 v38.25,39
  other vias: 43,51.5
!RESET_CODEC  (via drill 0.4)
  Top 0.2: U10.97 19.5,27.5 19.75,27.75 20,27.75 v20.25,28 | U3.14 41.5,31.65 41.5,32.5 41.25,32.75 39.5,32.75 v39.25,32.5
  Bottom 0.2: v20.25,28 24.75,32.75 39,32.75 v39.25,32.5
!SD_CARD
  Top 0.2: U10.27 12,51.5 10.6,52.9 SD1.SWB
A3.3V
  Top 0.5: 36.85,24.9 36.85,29.9 L20.2 | L15.2 47.25,24.5 47,24.75 C70.1 36.85,24.9 | U7.5 36.35,24.4 36.85,24.9
AGND  (via drill 0.4)
  Top 0.2: LINE_IN.5 7.45,2.8 v7,2.75 | U4.2 42.38,17.39 v42.5,17.5 | C64.2 35.75,33 C65.2 | U10.117 25.75,32.25 v25.5,32 | U3.20 45.48,30.77 v46,30.25 | PHONE_OUT.5 31.05,2.8 v31.25,3
  other vias: 42.75,13.25 48.5,13.25 37,18.5 43.25,23.75 45.25,23.75 41.25,23.75 42.25,27 44.25,27 46.25,27 36.75,32 37,22.75 31.75,23.75 32.5,28.25 8.25,68 7.25,68 8.25,67 45.75,19.75 25.5,31
  pour Route2: 6,0 6,5.75 0,5.75 0,68.75 9.25,68.75 9.25,66.5 3.5,66.5 3.25,26 6,23.25 6,14.5 19.75,14.5 20.75,13.5 20.75,2 21,1.75 28.5,1.75 28.75,2 28.75,12.75 31.5,15.5 31.5,29.5 30.75,30.25 25.25,30.25 25,30.5 25,32.25 25.5,32.75 49.75,32.75 49.75,6 44.25,6 44,5.75 44,0
  pour Bottom: 6,0 6,14.5 19.75,14.5 20.75,13.5 20.75,2 21,1.75 28.5,1.75 28.75,2 28.75,12.75 31.5,15.5 31.5,29.5 30.75,30.25 25.25,30.25 25,30.5 25,32.25 25.5,32.75 49.75,32.75 49.75,6 44.25,6 44,5.75 44,0
  pour Top: 6,0 6,14.5 19.75,14.5 20.75,13.5 20.75,2 21,1.75 28.5,1.75 28.75,2 28.75,12.75 31.5,15.5 31.5,29.5 30.75,30.25 25.25,30.25 25,30.5 25,32.25 25.5,32.75 49.75,32.75 49.75,6 44.25,6 44,5.75 44,0
ALL_GND  (via drill 0.4)
  Top 0.2: BATTERY.- v2,88.5 | BATTERY.X1 v8.5,92.75 | v8.5,86.25 BATTERY.X2
  other vias: 7,86.25 7,92.75 1,88.5 3,88.5 7.25,99 8.25,98.25 10.25,98.5 12.75,98.5 14.75,99 15.75,98.25 9.25,96.25 9.25,95.25 9.25,94.25 7.5,84 6.75,82.5 10.25,70 10.25,71 8.25,70 9.25,70 8.25,71 7.25,70 3.25,79 3.25,78 4,78.5 4.75,79 4.75,78
  pour Route2: 0,100 16.5,100 16.5,69.25 0,69.25
  pour Top: 0,100 17,100 17,94.5 10,94.5 10,85.5 14.25,85.5 14.25,69.25 0,69.25
AUDIO  (via drill 0.4)
  Top 0.2: U10.116 32,31.75 32.75,31 v33.5,31 | v49.25,30 49.25,20.25 49.5,20 49.5,17
  Top 0.3: U4.7 48.5,17.39 | 48.5,17.39 49.12,17.39 49.5,17 49.5,11.6 C53.1 | R7.1 48.5,17.39
  Bottom 0.2: v49.25,30 48.25,31 v33.5,31
AUX_!CHANGE  (via drill 0.4)
  Top 0.2: v95,93.75 95,96.5 92,99.5 74.5,99.5 v73.75,98.85
  Bottom 0.2: U11.28 74,98.5 v73.75,98.85 | v95,93.75 TO_MAIN1.10
AUX_BLUE_BOT
  Bottom 0.3: Q7.1 83.95,2.05 83.75,2.25 83.75,4.5 83.25,5 TO_MAIN2.7
AUX_BLUE_TOP
  Bottom 0.3: TO_MAIN2.4 74.95,9 Q6.1
AUX_CS  (via drill 0.4)
  Top 0.2: v71.25,90.75 79,90.75 80.25,92 92.5,92 93,92.5 v93,93.5
  Bottom 0.2: U11.14 73.5,92 72.25,90.75 v71.25,90.75 | v93,93.5 TO_MAIN1.8
AUX_GREEN_BOT
  Bottom 0.3: TO_MAIN2.5 83.5,7 84.75,5.75 Q5.1
AUX_GREEN_TOP
  Bottom 0.3: TO_MAIN2.6 77,7 76,6 74.8,6 Q4.1
AUX_MISO  (via drill 0.4)
  Top 0.2: v71.5,92.25 78.75,92.25 79.5,93 88.62,93 89,93.38 v89,93.5
  Bottom 0.2: U11.16 71.85,92.6 v71.5,92.25 | v89,93.5 TO_MAIN1.4
AUX_MOSI  (via drill 0.4)
  Top 0.2: v70.5,91.5 79,91.5 80,92.5 90.75,92.5 91,92.75 v91,93.5
  Bottom 0.2: U11.15 73,92 72.5,91.5 v70.5,91.5 | v91,93.5 TO_MAIN1.6
AUX_RED_BOT
  Bottom 0.3: TO_MAIN2.3 82.38,8.75 84.55,8.75 Q3.1
AUX_RED_TOP
  Bottom 0.3: TO_MAIN2.8 76,5 75.75,4.75 75.75,3 75.5,2.75 74.8,2.75 Q2.1
AUX_SCLK  (via drill 0.4)
  Top 0.2: v70.5,92.75 70.75,93 78.75,93 79.25,93.5 86.88,93.5 TO_MAIN1.2 v87,93.75
  Bottom 0.2: U11.17 71.25,93.5 v70.5,92.75 | v87,93.75 TO_MAIN1.2
AUX_VDD  (via drill 0.4)
  Top 0.2: v87,98.5 87,98.75 86.75,99 82.5,99 82,98.5 82,95.5 81.5,95 C85.1 69,95 | R28.2 69.25,98.75 69,98.5 69,95 | 69,95 C86.1
  Bottom 0.2: v87,98.5 TO_MAIN1.1 | U11.18 70.25,94 69,92.75 C86.1 | U11.4 78.75,95.5 C85.1
  Bottom 0.3: TO_MAIN1.5 TO_MAIN1.3 87.12,98.38 v87,98.5
  other vias: 69,90.75 69.5,98.75 79.25,95
AUX_VDD2  (via drill 0.4)
  Top 0.5: v59.5,15.5 v59.5,10 59.5,6.25 61.5,4.25 v79.75,4.25 98.25,4.25 101.75,7.75 v103,7.75 104.25,9 104.25,15.25 103,16.5 v102,16.5
  Bottom 0.2: 98,92.25 LED_UR.2-2 98,92 LED_UR.2
  Bottom 0.3: LED_LR.2 102,8.9 LED_LR.2-2 | LED_LL.2 58,10.6 LED_LL.2-2 | LED_UL.2 61,89.4 LED_UL.2-2 | v103,7.75 102.85,7.75
  Bottom 0.5: 82,11 TO_MAIN2.1 79.75,11 | TO_MAIN2.2 79.75,11 | v59.5,10 59,10.5 58.1,10.5 LED_LL.2-2 | 79.75,11 v79.75,4.25 | v59.5,15.5 58,17 58,82.25 62,86.25 LED_UL.2-2 | v102,16.5 102,81 97.25,85.75 96.25,85.75 95.5,86.5 95.5,90.75 96.85,92.1 LED_UR.2-2 | v103,7.75 LED_LR.2-2
AUX_VSS
  Bottom 0.2: U11.5 74.5,95 U11.GND
  pour Bottom: 55.25,100 105,100 105,94.25 94.75,94.25 94.75,90 64.25,89.75 64.25,94.25 55.25,94.25
AUX_VSS1
  Bottom 0.3: TO_MAIN2.10 78,3 | 78,3 TO_MAIN2.9 82.25,2.88 82.25,1 82.5,0.75 85.25,0.75 85.75,1.25 85.75,4 | Q6.2 74.05,7.3 73.75,7 73.75,4 | 73.75,4 73.75,1 74,0.75 74.7,0.75 Q2.2 74.8,0.75 76.75,0.75 77.38,1.38 77.38,2.38 78,3 | 73.75,4 73.8,4.05 Q4.2 | 85.75,7.25 84.8,7.25 Q5.2 | 85.75,7.25 85.75,10.25 85.55,10.45 Q3.2 | 84.8,4 Q7.2 85.7,3.95 85.75,4 | 85.75,7.25 85.75,4
AVDD  (via drill 0.4)
  Top 0.2: U2.20 42.75,63.5 C20.1 | U2.23 40.75,65.5 C14.1 | U2.26 U2.27 | U2.27 U2.28 | U2.27 C5.1 C4.1 | U2.31 35.75,63.5 C1.1 | U1.16 36.48,72.03 C19.1
  Top 0.254: U1.1 36.4,71.1 C8.1 C7.1 | U1.13 29.98,73.97 C13.1 C12.1 | U1.10 40.08,78.12 C9.1 C10.1
  other vias: 35.25,64 38.75,65.75 37.25,67.5 36.25,71 34.25,71 36,72.5 29.95,74 27.95,74.05 41.5,66.25 44.25,65 40.25,78.3 40.25,80.25 43.25,76 28.75,76.5 28.5,66 28.75,64.5 28.75,78.5
  pour Route3: 49.75,63.75 27.5,63.75 27.5,85.75 35.75,94 49.75,94
AVDD_CODEC  (via drill 0.4)
  Top 0.2: U10.118 31.25,32.75 C64.1 32.5,32 C65.1
  Top 0.3: U3.19 44.83,30.18 45.25,29.75 45.25,29 | 45.25,29 C31.1 | 45.25,29 C30.1 L15.1 | U4.6 46.88,16.11 47.75,15.25 C39.1
  other vias: 48.5,15.25 47.25,25.75 45.25,25.75 46.25,29 34.75,30 34.75,32 37,16.5 30.75,11 16.75,13.25
  pour Route3: 6,0 6,14.5 19.75,14.5 20.75,13.5 20.75,2 21,1.75 28.5,1.75 28.75,2 28.75,12.75 31.5,15.5 31.5,29.5 30.75,30.25 25.25,30.25 25,30.5 25,32.25 25.5,32.75 49.75,32.75 49.75,6 44.25,6 44,5.75 44,0
AVR_VDD  (via drill 0.4)
  Top 0.2: U10.142 29,44.75 C75.1 29.25,45.5 29.75,46 32,46 32.5,45.5 C74.1 | U10.143 28.25,45.25 28.5,45.5 28.5,46.25 C78.1 29.25,47.5 30,48.25 C77.1 | U10.2 24.5,49.25 25.5,50.25 C57.1 26,50.25 C58.1 | U10.48 C51.1 C50.1 | U10.64 C49.1 C48.1 | U10.103 22.5,24.5 C41.1 C40.1 | U10.10 20.5,49 C35.1 | JTAG.4 26.02,16.73 v26.25,16.5 | C37.1 L16.1 | U10.130 29.25,38.75 C33.1 29.75,38.5 30,38.25 32.75,38.25 33,38.5 C32.1 | C43.1 10.25,23.75 | U10.81 11.5,25 v11.25,24.75 11,24.75 C43.1 | C42.1 9.25,24.5 C43.1 | U10.21 C56.1 15,49.5 | SD1.VDD 3.81,60.7 v4,60.5
  other vias: 3.75,33.5 3.75,32.25 3.75,28.75 3.75,40.25 13,54.75 15,49.25 19.5,50 19.75,55.25 25.5,50.75 26,48.75 29.25,47 30,48.5 29.25,45 32.5,45 29.75,39.25 28,23.5 22,24.5 20,24.5 14.75,63 16.75,63 33,39.25 3.75,41.5 4.5,48.25 7.25,53 14,60.5 4,51 4,53
  pour Route3: 3.75,16.25 28.75,16.25 29.5,17 29.5,26.5 28.75,27.25 23.75,27.25 23,28 23,37 23.5,37.5 37.75,37.5 37.75,43 36.25,44.5 36.25,46.25 31.75,46.25 31.75,52.75 20.5,64 3.75,64
BAT  (via drill 0.4)
  Top 0.2: U2.29 37.75,66 37.25,66.5 34.5,66.5 34,67 31.25,67 29.25,69 28.5,69 27,70.5 27,75 27.75,75.75 27.75,87.25 24.5,90.5 v13.75,90.5
  Top 0.3: C60.1 6.75,78.9 F1.1 5.75,76.4 U6.10
  Top 0.5: BATTERY.+ v9.25,90.5
  Bottom 0.2: v13.75,90.5 v9.25,90.5
  Bottom 0.3: R11.2 1.5,81 2,81.5 4.5,81.5
  Bottom 0.5: C60.1 6.25,81 5,81 4.5,81.5 4.5,89.75 3.75,90.5 BATTERY.+
  other vias: 6.75,80.5 2.25,90.5 1.5,77.5
BCLK  (via drill 0.4)
  Top 0.2: v19.25,32.5 16.5,29.75 U10.91 16.5,25.25 16.25,25 13.75,25 13.5,25.25 U10.85 13.5,29 8.75,33.75 U10.61 | v48.5,34 46.12,36.38 U3.4 46.12,38.38 46.75,39 46.75,40.25 47,40.5 47.75,40.5 48.5,41.25 48.5,50.5 46,53 L9.1
  Bottom 0.2: v19.25,32.5 22,35.25 47.25,35.25 v48.5,34
BLUE_BOT
  Top 0.2: TO_AUX1.8 25.5,5 25,5.5 25,12.75 24,13.75 22.75,13.75 22.5,14 22.5,14.25 21,15.75 20.75,16 20.75,21.25 20.5,21.5 19,21.5 18.75,21.75 18.75,24 18.25,24.5 13.5,24.5 13,25 U10.84
BLUE_TOP
  Top 0.2: TO_AUX1.3 23,9 23.5,9.5 23.5,12 23.25,12.25 21.25,12.25 21,12.5 21,13.5 19.25,15.25 19.25,19.25 19,19.5 6,19.5 5.25,20.25 5.25,26.25 7,28 7,30 6.75,30.25 U10.68
CTS  (via drill 0.4)
  Top 0.2: SERIAL.5 3.69,21.81 v2.75,21.75 | v8.25,32.75 7.75,33.25 U10.62
  Bottom 0.2: v2.75,21.75 8.25,21.75 8.75,22.25 8.75,32.25 v8.25,32.75
D3.3V  (via drill 0.4)
  Top 0.2: U8.5 41.5,44.25 | 41.5,44.25 C79.1 | U9.1 47.62,45.88 C81.1 C80.1 | 41.5,44.25 L14.2 | CC_DEBUG.2 33.89,46.89 v33.25,47
  Top 0.5: U5.3 12.4,70.75 v12.9,71.25 | C61.1 13.75,69.4 v12.9,70.25
  Top 0.7: 11.75,70.1 v11.9,70.25
  other vias: 47.5,45.5 41.5,45.5 47.5,43.5 42.25,43.5 28,14.5 29.04,59.04 26.75,64.5 28,96.75 16.75,65 26.75,76.5 24.75,98.75 11.9,71.25 13.75,68.5
  pour Route3 (rank 3): 0,100 49.75,100 49.75,0 0,0
D+_UC
  Top 0.2: U10.6 R15.2 22.5,54.5 24.75,56.75 24.75,86 24,86.75 12.5,86.75 11.5,87.75 USB.3
D-_UC
  Top 0.2: U10.5 23,51 R17.2 23.5,54.5 25.25,56.25 25.25,86.5 24.5,87.25 12.75,87.25 12.15,87.85 USB.2
DGND  (via drill 0.4)
  Top 0.2: U1.14 39.42,73.33 | U1.12 38.77,73.97 v39.25,73.5 39.42,73.33 | 39.42,73.33 U1.GND | U1.8 40.73,73.97 U1.9 41.35,74.9 v41.5,75 | TO_AUX2.10 v40,98.75 | TO_AUX2.8 v38,98.75 | TO_AUX2.6 v36,98.75 | X1.2 v43.5,69.25 | X1.4 47.15,67.15 v47.25,67.25 | U3.6 44.83,38.08 45,38.25 45,39.25 v44.5,39.75 | U10.131 28.25,39.25 v28.5,39.5 | RESET.3 13.65,21.65 v13.75,21.75 | JTAG.2 v27.5,16.5 | JTAG.10 v22.5,16.5 | v22.25,3 TO_AUX1.9 | v27.25,3 TO_AUX1.10 | X2.GND-2 15.65,53.35 v15.5,53.5 | X2.GND-1 v17.25,55.5 | U10.20 v15.5,46.25 | U10.7 22,46.5 22.25,46.25 v22.75,46.25 23.25,46.25 23.5,46.5 U10.4 | U10.140 25.5,43.75 v25.25,44 | U10.144 v25.25,45.75 | U10.65 v7.25,31.75 | U10.47 v7.5,40.75 | U10.82 v12,28 | U10.102 v22,28 | R6.1 C1.2 | U9.2 47,47.75 45.75,46.5 v45.75,45.5 C81.2 | U9.7 45.5,48.75 v45.75,48.5 | CC_DEBUG.1 35.86,46.89 v35.75,47 | U8.3 39.1,45.6 v39,45.5 | v46.5,88 47.71,88 SMA.GND4 | SMA.GND2 46.54,93.04 v46.5,93 | C80.2 v45.75,43.5 | SERIAL.6 3.1,24.35 v4.25,26.25 | GPIO.4 10.6,22.35 C43.2 | SD1.VSS 5.11,62.9 v5.5,62.5 | SD1.GND3 11.57,65.67 v10.25,67 | SD1.GND4 11.57,58.17 C55.2 | C95.2 6,53.86 SD1.SWA 6.72,54.94 SD1.GND1 | SD1.GND2 4,66.25 v4.5,65.75
  Top 0.5: U5.2 U5.4 | U5.4 18.52,73.5 v18.5,73.5 v18.5,74.75 v18.5,76 | U5.4 18.6,72.35 v18.5,72.25 v18.5,71
  Bottom 0.2: SMA.GND4 v47.75,88 | SMA.GND2 v47.75,93
  other vias: 30,96.75 35.5,79 35.5,85 41.5,85 42.25,80.25 42.25,78.25 32.25,70.75 34,72.5 29.95,72 27.95,72 34.25,69 36.25,69 33,68 33.25,64 35.25,67.5 38.75,67.75 41.5,68.25 45.5,72.75 47.5,72.75 46.25,65 46.25,63 39.25,72.5 40.25,72.5 40.25,73.5 32,60 33.25,58 34.5,56 42,54.75 44,57 27,54.25 25,54.25 27.5,50.75 28,48.75 30,50.5 31.25,47 31.25,45 31.25,43 34.5,43 34.5,45 43.25,42 45.75,42 31.75,39.25 35,39.25 20,22.5 22,22.5 26,14.5 3.75,35.5 3.75,30.25 3.75,43.5 41,51.5 3.75,38.25 43.5,45.5 17.5,57.5 17.5,50 19.75,57.25 19.5,52 15,51.25 13,56.75 28,25.5 14.75,65 18,98.75 27.54,60.54 39.5,61.25 38,61.25 41,61.25 41,62.75 39.5,62.75 38,62.75 38,59.75 39.5,59.75 41,59.75 26.75,78.5 28.5,68 49,93 49,88 45,89 43.75,89 42.5,89 41.25,88.75 40,86.75 40.25,88 45,92 43.75,92 42.5,92 41.25,92 39,91.25 38,90.5 37.25,89.5 37,88.25 37,87 37,83.75 37,82.5 37,81.25 37,80.25 40,83.75 40,82.5 40,81.5 37,77.5 37,76.25 37,75 11.75,68.5 10.25,68 12,23.75 6.75,24.5 6,53 6,51
  pour Route2 (rank 2): 0,100 49.75,100 49.75,-0.25 6,0 6,23.25 3.25,26 3.25,69.25 0,69.25
  pour Top (no thermals): 36.5,53.25 49.75,53.25 49.75,63.25 44,63.25 44,63.75 49.75,63.75 49.75,94 35.75,94 27.5,85.75 27.5,63.75 33,63.75 33,63.25 27.5,63.25 27.5,62.25
DIN  (via drill 0.4)
  Top 0.2: v48.5,36 48.08,36.42 U3.1 48.08,37.33 49.5,39 49.5,53.25 L13.1 | U10.86 14,29.5 v14.25,29.75
  Bottom 0.2: v48.5,36 48.25,36 48,36.25 20.75,36.25 v14.25,29.75
DOUT  (via drill 0.4)
  Top 0.2: U10.92 17,29.25 v19,31.25 | v44.25,38.5 44.25,37.35 U3.7 44.17,36.33 44.5,36 45.5,36 v47.5,34
  Bottom 0.2: v19,31.25 22.5,34.75 46.75,34.75 v47.5,34 | v44.25,38.5 43.25,38.5 42.5,39.25 42.5,42.5 42.75,42.75 43.25,42.75 43.5,43 43.5,43.75 44.25,44.5 44.25,55.75 45.5,57 L11.1
  other vias: 48,57
DVDD_CODEC  (via drill 0.4)
  Top 0.2: U3.8 43.52,39.52 C28.1 | U3.5 45.48,38.48 45.75,38.75 C29.1
  other vias: 43.25,40 45.75,40 44.25,43.5
  pour Route3: 49.75,33.25 40,33.25 40,41.5 42.5,44 49.75,44
GREEN_BOT  (via drill 0.4)
  Top 0.2: TO_AUX1.6 v27.25,7 | U10.139 23.25,43.25 22.75,42.75 v22.75,29.25
  Bottom 0.2: v27.25,7 25.25,9.25 24.5,10 24.5,27.5 v22.75,29.25
GREEN_TOP
  Top 0.2: TO_AUX1.5 23.5,7 24,7.5 24,12.25 23.5,12.75 21.75,12.75 21.5,13 21.5,13.75 19.75,15.5 19.75,19.5 19.25,20 6.25,20 5.75,20.5 5.75,26 7.5,27.75 8.25,27.75 8.5,27.5 U10.75
IN_L
  Top 0.2: LINE_IN.4 16.7,9.3 15.5,10.5 C38.1 14.5,14.25 12.75,14.25 12.25,13.75 R19.2
IN_R
  Top 0.2: LINE_IN.1 C36.1
IOVDD  (via drill 0.4)
  Top 0.2: U2.40 C18.1 | U2.18 43.75,62.5 C11.1 | U2.12 43.5,59.5 C6.1 | U2.10 41.75,57.25 C2.1 | L3.1 C16.1 | U2.37 34.5,60.5 C17.1
  other vias: 34,60 36.5,56 42,56.75 44,59 44.25,63 48.75,62.25 30.46,60.46 28.96,61.96
  pour Route3: 27.5,63.25 49.75,63.25 49.75,53.25 36.5,53.25 27.5,62.25
LINEIN_SENSE
  Top 0.2: R13.1 20,13.25 20.5,12.75 20.5,6.65 LINE_IN.3 18.75,2.25 19.5,1.5 28.5,1.5 29,2 29,12.75 30.25,14 33,14 34,15 34,28.25 31.5,30.75 U10.114
  Top 0.3: 18.5,4.65 LINE_IN.3
LNA_EN  (via drill 0.4)
  Top 0.2: U1.6 43.58,72.67 v44,72.25 | v35.25,59.75 35.5,60 U2.38
  Bottom 0.2: v44,72.25 44,71 42.25,69.25 42.25,59 42,58.75 36.25,58.75 v35.25,59.75
MCI-CLK
  Top 0.2: SD1.CLK 7.96,61.8 9.5,60.25 9.5,57 10.5,56 11,56 11.75,55.25 11.75,53.25 12.5,52.5 U10.26
MCI-CMD
  Top 0.2: SD1.CMD 8.4,59.59 9,59 9,53 | 9,53 9,52.5 11.5,50 U10.28 | R22.1 9,53
MCI-DATA0
  Top 0.2: SD1.DAT0 8.26,63.99 13.5,58.75 13.75,58.75 R20.1 U10.23
MCI-DATA1
  Top 0.2: U10.14 18.5,58 17,59.5 13.5,59.5 7.96,65.05 SD1.DAT1
MCI-DATA2
  Top 0.2: SD1.DAT2 7.61,57.4 8.25,56.75 8.25,52.5 11,49.75 U10.29
MCI-DATA3  (via drill 0.4)
  Top 0.2: SD1.CD/DAT3 8.01,58.49 v8.25,58.25 | U10.30 10.5,49 v8.75,50.75
  Bottom 0.2: v8.25,58.25 8.25,51.25 v8.75,50.75
MCLK  (via drill 0.4)
  Top 0.2: v47.5,39.25 47.5,39 46.75,38.25 46.75,37.3 U3.3 | U8.2 40,46.5 40.25,46.75 v45,46.75 46.5,48.25 U9.3
  Bottom 0.2: L8.1 v45,46.75 45,41.5 45.5,41 47,41 47.5,40.5 v47.5,39.25
  other vias: 45,53.75
MISO0  (via drill 0.4)
  Top 0.2: U10.136 28,41.75 28.5,41.25 36.25,41.25 36.5,41.5 39.75,41.5 40.75,40.5 42.25,40.5 | U2.6 39.75,55.25 40,55 v40,53.75 | U3.9 42.88,38.88 42.25,39.5 42.25,40.5 | v33.25,52 v33.25,51.99 CC_DEBUG.10 33.3,52 34.75,52 35,51.75 35,46 35.5,45.5 35.5,43 35.75,42.75 36.25,42.75 36.5,42.5 41.75,42.5 42.25,42 42.25,40.5
  Bottom 0.2: 33.3,52 CC_DEBUG.10 | CC_DEBUG.10 v33.25,52 | v40,53.75 39.75,54 38.75,54 38.5,54.25 33.5,54.25 33.25,54 v33.25,51.99 CC_DEBUG.10
MISO1  (via drill 0.4)
  Top 0.2: TO_AUX2.3 v34,93.25 | U10.11 20,45.75 v20.75,45
  Bottom 0.2: v34,93.25 34,94.25 33.75,94.5 23.5,94.5 20.75,91.75 v20.75,45
MOSI0  (via drill 0.4)
  Top 0.2: 25.25,42.75 23.75,42.75 23.5,42.5 v23.5,37 | U3.12 40.98,37.27 v40.75,37 | U2.5 v39.25,54.75 39.25,53.5 39.75,53 39.75,47.75 40.25,47.25 U9.10 | U10.138 25.25,42.75 | 25.25,42.75 v25.25,42.5 | CC_DEBUG.8 33.3,50.7 v33.25,50.75
  Bottom 0.2: v23.5,37 23.75,36.75 40.5,36.75 v40.75,37 | v25.25,42.5 25.5,42.75 27.75,42.75 28,43 28,47.5 28.75,48.25 28.75,49 29.25,49.5 31.25,49.5 32.5,50.75 | 32.5,50.75 v33.25,50.75 | v39.25,54.75 33,54.75 32.5,54.25 32.5,50.75
MOSI1  (via drill 0.4)
  Top 0.2: TO_AUX2.5 v36,93.25 | v17.5,45.25 U10.16
  Bottom 0.2: v36,93.25 36,94.5 35.5,95 23,95 20,92 20,60.25 18.5,58.75 18.5,46.25 v17.5,45.25
N$1
  Top 0.2: U2.21 42,64.25 43.75,66 45.75,66 46,66.25 46,69 46.25,69.25 47,69.25 X1.1 47.55,69.5 C26.1
N$2
  Top 0.2: U2.22 41.25,65 41.5,65.25 42.25,65.25 43.25,66.25 43.25,67 X1.3 44.85,67.1 45.5,67.75 C27.1
N$3
  Top 0.2: U2.11 43,58.5 L7.1
N$4
  Top 0.2: U2.16 46.5,61.5 48,60 L11.2
N$5
  Top 0.2: U2.14 45.5,60.5 46,60 L9.2
N$6
  Bottom 0.2: R36.1 C94.2 68.25,96 U11.22
N$7
  Top 0.2: R2.2 32.25,73 32.75,73.5 36.75,73.5 37,73.25 37,73 37.33,72.67 U1.15
N$8
  Top 0.2: U1.7 42.55,73.33 R1.1
N$9
  Top 0.44: C22.2 arc-90 41.5,90.5 SMA.SIG
N$10
  Top 0.3: AVR1.A 1.25,47 R5.1
N$11  (via drill 0.4)
  Top 0.2: 64.75,83 PLAY/PAUSE.P$1 64.75,82.75 v64.75,95
  Bottom 0.2: R36.2 65.25,98.25 65,98 65,95.5 v64.75,95
N$12
  Top 0.3: R8.1 1.25,29.25 AVR.A
N$13
  Top 0.4: U1.11 39.42,75.58
  Top 0.44: 39.42,75.58 arc90 L4.1
N$14
  Top 0.4: L4.2 38.5,79 | 38.5,79 L5.1 | C23.1 38.5,79
N$15
  Top 0.4: L5.2 C21.1
N$16
  Top 0.4: L6.2 38,85 arc90 C22.1 | C21.2 C22.1 | C24.1 39,85 arc-90 C22.1
N$17
  Bottom 0.2: U11.23 69.75,96.5 C94.1
N$18
  Top 0.2: U2.36 35,61 L12.1
N$19
  Top 0.2: R3.2 36.5,66 37.25,65.25 U2.30
N$20
  Top 0.2: C52.2 C98.1 R9.2
N$21
  Top 0.2: U2.39 36,59.5 35.25,58.75 C25.1
N$22  (via drill 0.4)
  Top 0.2: U7.3 33.15,22.35 v33,22.25 | v33,25.25 33.25,24.5 U7.1
  Top 1: C71.1 32.5,25.5 v33,25.25
  Bottom 1: v33,25.25 v33,22.25 L21.1
  other vias: 33,21
N$23
  Top 0.2: U2.13 44.75,60 45,59.75 L8.2
N$24
  Top 0.2: C67.2 C99.1 36,14.5 R14.2
N$25
  Top 0.2: U2.15 46.25,61 47,60.25 L10.2
N$26
  Top 0.3: U4.1 39.09,18.66 C63.1
N$27
  Top 0.2: U2.17 46.75,62 49,59.75 L13.2
N$28  (via drill 0.4)
  Top 0.3: U2.9 41.25,57.75 41,57.5 v41,55.75
  Bottom 0.3: R4.1 49.5,68.5 49.5,58.5 49,58 41.5,58 41,57.5 v41,55.75
  other vias: 49,69
N$29
  Top 0.3: R4.2 49,65.5 CC1.C
N$30
  Bottom 0.2: R32.1 81.25,88.75 81,88.5 79,88.5 C90.2 76,91.5 U11.9
N$31
  Top 0.3: POWER.A R12.1
N$32
  Top 0.3: CHARGE.C 2.75,70.75 4,72 U6.8
N$33
  Top 0.3: CHARGE.A R11.1
N$34
  Top 0.2: U10.141 28.5,44.25 28.75,44 29.25,44 | C69.1 29.25,44 | C68.1 32.75,43 31.75,44 29.25,44
N$35  (via drill 0.4)
  Top 0.2: U10.45 14.5,41.75 v15.75,40.5 | v43,50.25 43.5,50.25 44.5,49.25 U9.5
  Bottom 0.2: v15.75,40.5 21.75,40.5 24.5,37.75 39.75,37.75 40.25,38.25 40.25,47 41.25,48 41.25,49.75 41.5,50 42.25,50 42.5,50.25 v43,50.25
N$39
  Top 0.2: R17.1 U10.8
N$40
  Top 0.3: C66.1 47.75,7.5 47.25,8 47.25,12.75 46.75,13.25 R21.1 46,14.73 U4.5
N$41
  Bottom 0.2: R33.1 77.75,87.75 75.25,87.75 74.75,88.25 C91.2 75,89 U11.11
N$42
  Bottom 0.2: R34.1 C92.2 71.5,89.5 74,92 U11.13
N$43
  Bottom 0.2: R29.1 C87.2 80.25,98 78.75,98 77.75,97 U11.1
N$44
  Top 0.2: U6.2 4.5,82 R38.2
N$45
  Bottom 0.2: R30.1 82.25,97 C88.2 80.25,96 U11.3
N$46
  Top 0.2: U10.9 21,49.5 20.5,50 R15.1
N$47
  Top 0.2: U10.3 24,49.5 24.5,50 24.5,51.75 C76.1 R27.2
N$49
  Top 0.2: R40.1 36,20.5 35.5,20 C67.1
N$50  (via drill 0.4)
  Top 0.5: 12.5,76.22 U5.1 11.18,74.9 F1.2
  Top 1: U5.1 15.13,76.12 v15.5,75.75
  Bottom 1: v15.5,75.75 15.5,67.5 12.5,64.5 4.25,64.5 2.75,63 2.75,51.75 0.75,49.75 0.75,10.25 4,7 14,7 20.25,0.75 31.75,0.75 33,2 L21.2
  other vias: 33,19
N$51
  Top 0.2: R41.1 C52.1
N$52
  Top 0.2: U10.18 16.5,51 C83.1 17.5,53.25 X2.X1
N$53
  Top 0.2: 48.34,18.66 48.34,19.16 R9.1
  Top 0.3: U4.8 48.34,18.66 R7.2
N$54
  Top 0.3: R14.1 40.54,14.5 U4.4 43.41,14.85 44,14.25 R21.2
N$55
  Top 0.3: U4.3 39.38,16.11 R10.1
N$56
  Bottom 0.3: Q2.3 71,1.75 70.5,2.25 70.5,12.5 | 70.5,12.5 71.5,13.5 93.25,13.5 95,15.25 102.5,15.25 103,15.75 103,81.5 98,86.5 LED_UR.1-2 99,89.4 LED_UR.1 | 70.5,12.5 68.5,12.5 66.25,14.75 58,14.75 57,15.75 57,82.75 59.75,85.5 59.75,90.75 60,91 LED_UL.1 61,91.1 LED_UL.1-2
N$57
  Top 0.2: U10.19 16,52 15.75,52.25 15,52.25 14.5,52.75 14.5,55.25 14.85,55.6 X2.X2 15.65,57.35 C84.1
N$58  (via drill 0.4)
  Top 0.3: v66.75,12.75 v72.25,12.75
  Bottom 0.3: Q4.3 71.5,5 71.25,5.25 71.25,12 72,12.75 v72.25,12.75 93.75,12.75 95.5,14.5 103.25,14.5 103.75,15 103.75,82.5 102.75,83.5 102.75,88.15 LED_UR.4-2 102,89.4 LED_UR.4 | LED_UL.4-2 58.25,92.1 | 58.25,92.1 58.65,92.1 59.25,91.5 59.25,86.25 56.25,83 56.25,14.75 56.75,14.25 65,14.25 66.5,12.75 v66.75,12.75 | LED_UL.4 58,91.85 58.25,92.1
N$59
  Bottom 0.2: U11.32 77.4,97.9 78.5,99 C87.1
N$60
  Bottom 0.2: U11.8 76.65,92.35 79.5,89.5 C90.1
N$61  (via drill 0.4)
  Top 0.2: VOL+.P$1 91.25,40 83.5,47.75 83.5,89.25 R32.2
  other vias: 83.25,89.5
N$62
  Bottom 0.2: U11.10 75.5,90 C91.1
N$63  (via drill 0.4)
  Top 0.2: WIRELESS.P$1 69.75,20 78.5,28.75 78.5,86 R33.2
  other vias: 80,87.5
N$64
  Bottom 0.2: U11.12 74.5,90.5 73.5,89.5 C92.1
N$65  (via drill 0.4)
  Top 0.2: R34.2 75.5,88.75 76.5,87.75 76.5,47.75 68.75,40 VOL-.P$1
  other vias: 68.25,88.75
N$66
  Top 0.2: U6.9 4.5,73.75 R37.2
N$67  (via drill 0.4)
  Top 0.2: L17.1 27.4,11.9 TO_AUX1.2 26,12.4 C54.1 24,14.5 v23.5,14.5 | TO_AUX1.1 v22.25,11
  Bottom 0.2: v22.25,11 22.25,13.25 v23.5,14.5
  other vias: 26,12.5
N$69
  Top 0.2: U6.4 3.5,81.5 3.25,81.75 2,81.75 1.75,82 R39.2
N$71
  Bottom 0.2: R35.1 C93.2 68,92.5 70,94.5 U11.19
N$72  (via drill 0.4)
  Top 0.2: R35.2 66,89 67.75,87.25 73,87.25 74.5,85.75 74.5,66 68.5,60 PREV.P$1
  other vias: 66,94.25
N$76
  Bottom 0.2: U11.20 68.75,95 C93.1
N$77
  Bottom 0.2: U11.29 74.5,98.5 74.75,98.75 74.75,99 74.15,99.6 72.35,99.6 R28.1
N$78  (via drill 0.4)
  Top 0.3: v104,84.5 104,91.75 103.75,92 v103.25,92 | v66.25,11.75 72.55,11.75 v72.65,11.65
  Bottom 0.3: Q6.3 v72.65,11.65 73,12 94,12 95.75,13.75 104,13.75 104.5,14.25 104.5,84 v104,84.5 | LED_UR.3-2 103.1,92 v103.25,92 102.25,91 LED_UR.3 | v66.25,11.75 64.25,13.75 55.75,13.75 55.5,14 55.5,86.25 57,87.75 LED_UL.3-2 58,89.4 LED_UL.3
N$79  (via drill 0.4)
  Top 0.3: v103.25,11.5 100.75,11.5 98.75,9.5 v93.5,9.5 68,9.5 64.75,6.25 v64.75,5.5
  Bottom 0.3: Q3.3 v93.5,9.5 | LED_LR.1-2 102.9,11.5 v103.25,11.5 102.25,10.5 LED_LR.1 | LED_LL.1-2 57.6,7.9 | 57.6,7.9 60,5.5 v64.75,5.5 | 57.6,7.9 57.6,8.6 LED_LL.1
N$80  (via drill 0.4)
  Top 0.3: v67.25,6.25 v88,6.25
  Bottom 0.3: Q5.3 v88,6.25 94.5,6.25 95,6.75 95,10.5 96,11.5 97.9,11.5 LED_LR.4-2 99,10.6 LED_LR.4 | v67.25,6.25 65.75,6.25 64.1,7.9 LED_LL.4-2 62,8 LED_LL.4
N$83  (via drill 0.4)
  Top 0.3: v69,3 v88,3
  Bottom 0.3: Q7.3 v88,3 96.25,3 98,4.75 LED_LR.3-2 99,8.9 LED_LR.3 | LED_LL.3 61,10.6 LED_LL.3-2 62,11.5 65,11.5 68.75,7.75 68.75,3.25 v69,3
N$84
  Top 0.2: TO_AUX2.4 TO_AUX2.2 31.9,98.75 C62.1 L19.1
  Top 0.3: 31.85,98.5 TO_AUX2.2
N$85  (via drill 0.4)
  Top 0.2: STOP.P$1 92.5,86.5 88,91 v85.5,91
  Bottom 0.2: R29.2 85.25,98.5 85.5,98.25 v85.5,91
N$86
  Bottom 0.2: U11.2 78.75,96.5 C88.1
N$87  (via drill 0.4)
  Top 0.2: NEXT.P$1 91.5,60 85.5,66 85.5,87 v84.25,88.25
  Bottom 0.2: R30.2 83.75,95.5 84.25,95 v84.25,88.25
N$88
  Top 0.3: C47.1 41.25,28 C46.1 42.75,29 43.52,29.77 U3.17
N$89
  Top 0.3: U3.18 44.17,29.07 C44.1 43.75,29 43.25,28.5 C45.1
N$90
  Bottom 0.2: R31.1 C89.2 78.25,93 78,93.25 78,94.25 77.75,94.5 U11.6
N$91  (via drill 0.4)
  Top 0.2: C36.2 9,1.75 10.25,0.5 39,0.5 v40.25,1.75 | U3.15 42.25,31.7 42.25,30.75 v40.25,28.75
  Bottom 0.2: v40.25,1.75 v40.25,28.75
N$92  (via drill 0.4)
  Top 0.2: v39.25,2 38.25,1 12.25,1 11.5,1.75 11.5,10.5 13.5,12.5 C38.2 | U3.16 42.88,30.38 v42.75,30.25
  Bottom 0.2: v39.25,2 39.25,28.75 40.75,30.25 v42.75,30.25
N$93
  Bottom 0.2: U11.7 77.25,94 77.5,93.75 77.5,92.25 78.75,91 C89.1
N$94
  Top 0.2: U9.6 41,49.25 C82.1
N$95  (via drill 0.4)
  Top 0.2: BUTTON.P$1 90.25,20 81.5,28.75 81.5,90.75 R31.2
  other vias: 81.75,91
OUT_L
  Top 0.2: U3.23 47.42,30.82 48.75,29.5 48.75,21.25 48.25,20.75 42,20.75 41.75,21 R41.2
OUT_R
  Top 0.2: U3.22 46.77,30.73 48.25,29.25 48.25,23.25 47.75,22.75 39.5,22.75 39,22.25 R40.2
PA_EN  (via drill 0.4)
  Top 0.2: L12.2 R6.2 | U1.5 42.98,72.03 v43,72
  Bottom 0.2: v43,72 43,72.5 41.25,74.25 31.75,74.25 30.75,73.25 R6.2
  other vias: 30.75,62
PHONE_L
  Top 0.2: R25.2 40.75,10.25 41.75,9.25 42.7,9.25 PHONE_OUT.4
  Top 0.3: C53.2 44.2,10.75 PHONE_OUT.4
PHONE_R
  Top 0.3: C66.2 45.75,7.5 45.5,7.25 32.9,7.25 PHONE_OUT.1
PHONE_SENSE
  Top 0.2: PHONE_OUT.3 42.6,4.75 29.75,4.75 29.5,5 29.5,12.25 30.25,13 R16.1 32.75,13 34.5,14.75 34.5,28.5 31.75,31.25 U10.115
RED_BOT  (via drill 0.4)
  Top 0.2: 26.75,9 TO_AUX1.4 v27.25,9 | U10.132 24.5,39.75 24.25,39.5 v24.25,29
  Bottom 0.2: v27.25,9 25,11.25 25,28.25 v24.25,29
RED_TOP
  Top 0.2: TO_AUX1.7 24,5 24.5,5.5 24.5,12.5 23.75,13.25 22.25,13.25 22,13.5 22,14 20.25,15.75 20.25,20.75 20,21 18.75,21 18.25,21.5 18.25,23.75 18,24 13.25,24 12.5,24.75 U10.83
RF_N
  Top 0.254: U1.2 39.42,70.33 39.75,70 U2.25
RF_P
  Top 0.254: U1.4 40.73,70.47 40.25,70 U2.24
RTS  (via drill 0.4)
  Top 0.2: SERIAL.1 3.4,11.65 v3.25,11.5 | v8,30.5 8,32 7.25,32.75 U10.63
  Bottom 0.2: v3.25,11.5 2.75,11.5 1.75,12.5 1.75,22.25 2,22.5 7.75,22.5 8,22.75 v8,30.5
RXD  (via drill 0.4)
  Top 0.2: U10.55 9.25,36.75 v9.75,36.25 | v3.5,16.75 SERIAL.3
  Bottom 0.2: v9.75,36.25 9.75,21.75 8.75,20.75 4,20.75 3.5,20.25 v3.5,16.75
SCLK0  (via drill 0.4)
  Top 0.2: U3.10 42.23,38.52 v42,38.75 | v41.5,41.5 41,42 v36,42 35.75,41.75 28.75,41.75 28.25,42.25 U10.137 | U9.9 41,47.75 v40.5,48.25 | CC_DEBUG.6 33.43,49.43 v33.5,49.5 | v39.25,47 39.25,46.75 38.25,45.75 v36.25,45.75 | U2.4 38.75,56 38.5,55.75 v38.5,53
  Bottom 0.2: v42,38.75 41.5,39.25 v41.5,41.5 | v40.5,48.25 v39.25,47 | v33.5,49.5 35.5,49.5 | v36,42 36.25,42.25 v36.25,45.75 36.5,46 36.5,49.25 36.25,49.5 35.5,49.5 | v38.5,53 38.5,53.25 38,53.75 36.5,53.75 35.5,52.75 35.5,49.5
SCLK1  (via drill 0.4)
  Top 0.2: TO_AUX2.1 v32,93.25 | v24.75,41.25 U10.135
  Bottom 0.2: v32,93.25 23.25,93.25 21.5,91.5 21.5,57.25 23,55.75 23,48.25 24.25,47 24.25,41.75 v24.75,41.25
TCK
  Top 0.2: U10.107 24.5,24.75 27.5,21.75 27.5,20.54 JTAG.1
TDI
  Top 0.2: JTAG.9 22.25,20.46 22.25,19 22.5,18.75 28.5,18.75 29,19.25 29,26 28.65,26.35 U10.108
TDO
  Top 0.2: U10.105 23.5,24.75 26.25,22 26.25,20.52 JTAG.3
TMS
  Top 0.2: U10.104 23,24.25 25,22.25 JTAG.5
TXD  (via drill 0.4)
  Top 0.2: SERIAL.2 v3.5,14.25 | U10.59 v9,34.75
  Bottom 0.2: v9,34.75 9.25,34.5 9.25,22 8.5,21.25 3.75,21.25 2.75,20.25 2.75,15 v3.5,14.25
UC_MCLK  (via drill 0.4)
  Top 0.2: U10.13 v19,44 | U8.1 40.4,44.9 40,44.5 v39.5,44.5 39.35,44.35 U8.4
  Bottom 0.2: v19,44 24.75,38.25 39.5,38.25 39.75,38.5 39.75,44.25 v39.5,44.5
USBOTGID  (via drill 0.4)
  Top 0.2: USB.4 10.85,87.65 12.25,86.25 23.5,86.25 24.25,85.5 24.25,58.25 v21.5,55.5 | U10.121 25.5,34.25 25.25,34.5 v25.25,39
  Bottom 0.2: v21.5,55.5 21.5,42.75 v25.25,39
VBUS  (via drill 0.4)
  Top 0.2: U10.1 28.4,47.65 29,48.25 29,51.25 28,52.25 28,54.75 27.5,55.25 26.25,55.25 25.75,55.75 25.75,86.75 24.5,88 v13.5,88
  Top 0.3: U6.1 5,83.5 C59.1
  Top 0.4: USB.1 12.8,88.7 v13.5,88 | v5.75,88 5.5,87.75 C59.1
  Bottom 0.4: v5.75,88 v13.5,88
  other vias: 5.5,84
WCLK  (via drill 0.4)
  Top 0.2: U10.89 U10.90 16,30.25 v17.75,32 17.75,39.75 15.25,42.25 U10.44 | v48.5,35 47.42,36.08 U3.2 47.42,37.92 49,39.5 49,51.75 L10.1
  Bottom 0.2: v17.75,32 21.5,35.75 47.75,35.75 v48.5,35